# EAGLE schematic TamperEvidentAmplifier (EAGLE 7.5.0)
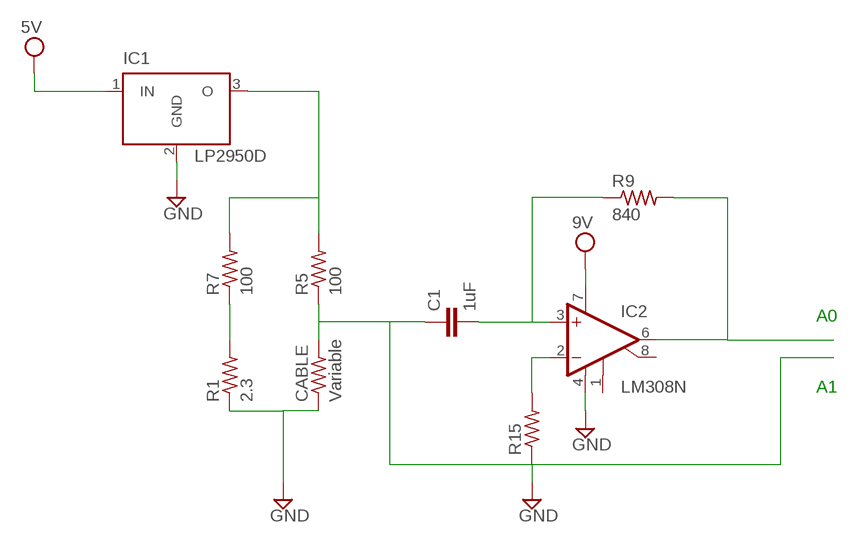
[diagram p0: schematic, sheet 1]

## Parts
C1  1uF  C7.5/6  [C7.5B6]
CABLE  Variable  R-US_0207/10  [0207/10]
IC1  LP2950D  [TO252]
IC2  LM308N  [DIL08]
R1  2.3  R-US_0207/10  [0207/10]
R5  100  R-US_0207/10  [0207/10]
R7  100  R-US_0207/10  [0207/10]
R9  840  R-US_0207/10  [0207/10]
R15  R-US_0207/10  [0207/10]

## Nets
GND: CABLE.1 IC1.2(GND) IC2.4(V-) R1.1 R15.1
N$1: IC1.3(O) R5.2 R7.2
N$3: C1.1 CABLE.2 R5.1
N$4: R1.2 R7.1
N$9: C1.2 IC2.3(+IN) R9.1
N$10: IC2.2(-IN) R15.2
N$12: IC2.6(OUT) R9.2
VCC: IC1.1(IN) IC2.7(V+) ; supply symbol labelled 9V, 5V
Unconnected: IC2.1(CMP1) IC2.8(CMP2)

## Notes on the sheet
- A0
- A1

## Library data of the parts
C1 = capacitor-wima:C: CAPACITOR naming: grid - package width
CABLE R1 R5 R7 R9 R15 = rcl:R-US_: RESISTOR, American symbol
IC1 = national-semiconductor:LP2950: Adjustable Micropower Voltage Regulator PIN-Connection corrected by http://www.ti.com/lit/ds/symlink/lp2950-n.pdf; MF: NATIONAL SEMICONDUCTOR; MPN: LP2950CDT-5.0/NOPB; OC_FARNELL: 1469117; OC_NEWARK: 41K6539
IC2 = linear:LM308: OP AMP